# Altium schematic sheet 3_esc_power_sw.SchDoc: ESC power switch
size A3; SheetNumber: 3; SheetTotal: 4
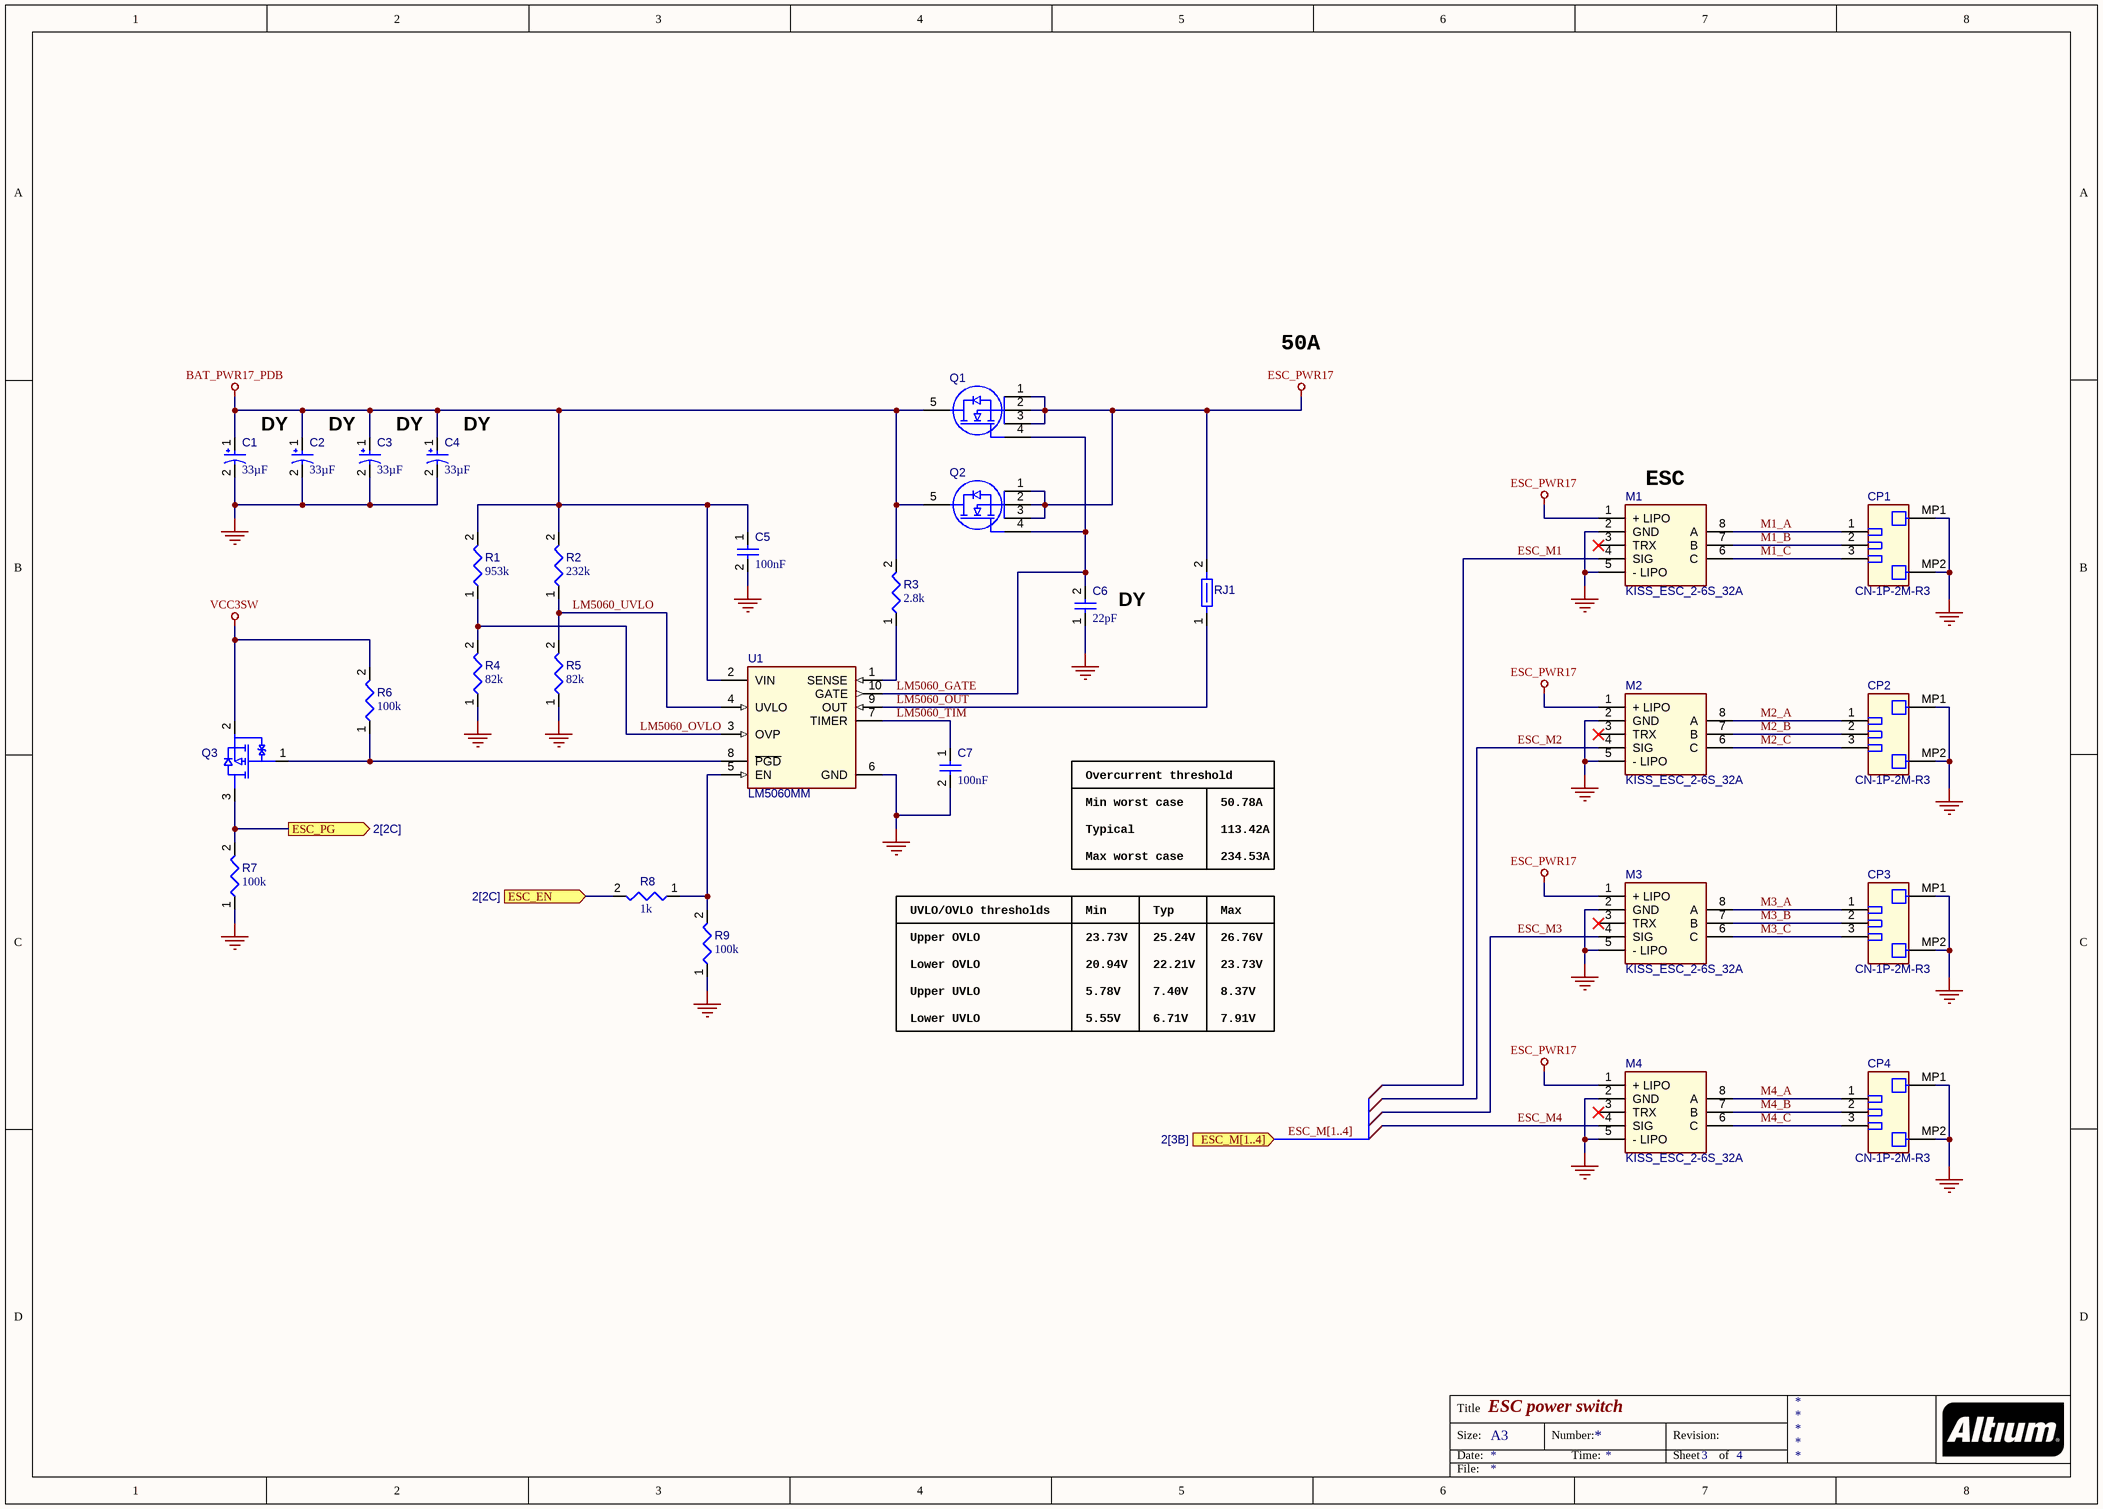
[diagram p0: 3_esc_power_sw.SchDoc]

## Parts
C1  value 33µF  [EEF-CX1E330R-Footprint-1]  (hidden comment: Capacitor 33µF +/-20% 25V 2917)
C2  value 33µF  [EEF-CX1E330R-Footprint-1]  (hidden comment: Capacitor 33µF +/-20% 25V 2917)
C3  value 33µF  [EEF-CX1E330R-Footprint-1]  (hidden comment: Capacitor 33µF +/-20% 25V 2917)
C4  value 33µF  [EEF-CX1E330R-Footprint-1]  (hidden comment: Capacitor 33µF +/-20% 25V 2917)
C5  value 100nF  [CAPC0402(1005)60_L]  (hidden comment: Capacitor 100nF +/-20% 50V 0402)
C6  value 22pF  [CAPC0402(1005)60_L]  (hidden comment: Capacitor 22pF +/-10% 50V 0402)
C7  value 100nF  [CAPC0402(1005)60_L]  (hidden comment: Capacitor 100nF +/-20% 50V 0402)
CP1  CN-1P-2M-R3  [MR30PW-FB-Footprint-1]
CP2  CN-1P-2M-R3  [MR30PW-FB-Footprint-1]
CP3  CN-1P-2M-R3  [MR30PW-FB-Footprint-1]
CP4  CN-1P-2M-R3  [MR30PW-FB-Footprint-1]
M1  KISS_ESC_2-6S_32A  [ESC 2-6S 32A-Footprint-1]
M2  KISS_ESC_2-6S_32A  [ESC 2-6S 32A-Footprint-1]
M3  KISS_ESC_2-6S_32A  [ESC 2-6S 32A-Footprint-1]
M4  KISS_ESC_2-6S_32A  [ESC 2-6S 32A-Footprint-1]
Q1  PSMN1R0-30YLDX  [NXP-SOT669_L]  (value not drawn)
Q2  PSMN1R0-30YLDX  [NXP-SOT669_L]  (value not drawn)
Q3  RZM002P02T2L  [ROHM-SOT723-3_V]  (value not drawn)
R1  value 953k  [RESC0402(1005)_L]  (hidden comment: Resistor 953K +/-1 % 0402 63 mW)
R2  value 232k  [RESC0402(1005)_L]  (hidden comment: Resistor 232K +/-1 % 0402 63 mW)
R3  value 2.8k  [RESC0402(1005)_L]  (hidden comment: Resistor 2K8  +/-1 % 0402 63 mW)
R4  value 82k  [RESC0402(1005)_L]  (hidden comment: Resistor 82K  +/-1 % 0402 63 mW)
R5  value 82k  [RESC0402(1005)_L]  (hidden comment: Resistor 82K  +/-1 % 0402 63 mW)
R6  value 100k  [RESC0402(1005)_L]  (hidden comment: Resistor 100K +/-1 % 0402 63 mW)
R7  value 100k  [RESC0402(1005)_L]  (hidden comment: Resistor 100K +/-1 % 0402 63 mW)
R8  value 1k  [RESC0402(1005)_L]  (hidden comment: Resistor 1K +/-5 % 0402 63 mW)
R9  value 100k  [RESC0402(1005)_L]  (hidden comment: Resistor 100K +/-1 % 0402 63 mW)
RJ1  Net Tie 10x8mil  [New footprint 1]  (value not drawn)  (net tie, no BOM)
U1  LM5060MM  [DGS0010A_N]

## Ports
ESC_EN (in, see 2[2C]), ESC_M[1..4] (in, see 2[3B]), ESC_PG (out, see 2[2C])

## Nets
BAT_PWR17_PDB: C1.1 C2.1 C3.1 C4.1 C5.1 Q1.5(D) Q2.5(D) R1.2 R2.2 R3.2 U1.2(VIN)
ESC_PWR17: M1.1(+_LIPO) M2.1(+_LIPO) M3.1(+_LIPO) M4.1(+_LIPO) Q1.1(S) Q1.2(S) Q1.3(S) Q2.1(S) Q2.2(S) Q2.3(S) RJ1.2
GND: C1.2 C2.2 C3.2 C4.2 C5.2 C6.1 C7.2 CP1.MP1 CP1.MP2 CP2.MP1 CP2.MP2 CP3.MP1 CP3.MP2 CP4.MP1 CP4.MP2 M1.2(GND) M1.5(-_LIPO) M2.2(GND) M2.5(-_LIPO) M3.2(GND) M3.5(-_LIPO) M4.2(GND) M4.5(-_LIPO) R4.1 R5.1 R7.1 R9.1 U1.6(GND)
VCC3SW: Q3.2(S) R6.2
ESC_EN: R8.2 ; port ESC_EN
ESC_M1: M1.4(SIG)
ESC_M2: M2.4(SIG)
ESC_M3: M3.4(SIG)
ESC_M4: M4.4(SIG)
ESC_PG: Q3.3(D) R7.2 ; port ESC_PG
LM5060_GATE: C6.2 Q1.4(G) Q2.4(G) U1.10(GATE)
LM5060_OUT: RJ1.1 U1.9(OUT)
LM5060_OVLO: R1.1 R4.2 U1.3(OVP)
LM5060_TIM: C7.1 U1.7(TIMER)
LM5060_UVLO: R2.1 R5.2 U1.4(UVLO)
M1_A: CP1.1 M1.8(A)
M1_B: CP1.2 M1.7(B)
M1_C: CP1.3 M1.6(C)
M2_A: CP2.1 M2.8(A)
M2_B: CP2.2 M2.7(B)
M2_C: CP2.3 M2.6(C)
M3_A: CP3.1 M3.8(A)
M3_B: CP3.2 M3.7(B)
M3_C: CP3.3 M3.6(C)
M4_A: CP4.1 M4.8(A)
M4_B: CP4.2 M4.7(B)
M4_C: CP4.3 M4.6(C)
NetQ3_1: Q3.1(G) R6.1 U1.8(~{PGD})
NetR3_1: R3.1 U1.1(SENSE)
NetR8_1: R8.1 R9.2 U1.5(EN)

Not connected (* = marked no-connect by the designer): M1 3(TRX)*; M2 3(TRX)*; M3 3(TRX)*; M4 3(TRX)*

## Buses and harness runs
bus ESC_M[1..4] = port ESC_M[1..4]

## Notes on the sheet
- 50A
- DY
- (near C4) DY
- (near M1) ESC
- (near C6) DY
- Overcurrent threshold
- Min worst case
- Typical
- Max worst case
- 50.78A
- 113.42A
- 234.53A
- UVLO/OVLO thresholds
- Min
- Typ
- Max
- Upper OVLO
- Lower OVLO
- Upper UVLO
- 23.73V
- 20.94V
- 5.78V
- 25.24V
- 22.21V
- 7.40V
- 26.76V
- 8.37V
- Lower UVLO
- 5.55V
- 6.71V
- 7.91V
- Title
- Size:
- Date:
- A3
- Number:
- Time:
- Revision:
- Sheet
- of
- File:

## Library data of the parts
C1-C4 = CMP-001-00064-3: Aluminum Organic Polymer Capacitors 33uF 25volt SP-Cap AEC-Q200; Tolerance: 20%; Case/Package: 2917; Voltage Rating: 25V; Mounting Technology: SMT; Min Operating Temperature: -40°C; Max Operating Temperature: 105°C; Pins: 2
C5 C7 = CMP-001-00067-3: Chip Capacitor, 100nF +/-20%, 50V, 0402, Thickness 0.6 mm; Tolerance: 10%; Mounting Technology: SMT; Voltage Rating: 50V; Pins: 2; Case/Package: 0402; Max Operating Temperature: 85°C; Min Operating Temperature: -55°C
C6 = CMP-001-00073-3: Chip Capacitor, 22pF +/-10%, 50V, 0402, Thickness 0.6 mm; Tolerance: 10%; Mounting Technology: SMT; Pins: 2; Voltage Rating: 50V; Case/Package: 0402; Max Operating Temperature: 85°C; Min Operating Temperature: -55°C
CP1-CP4 = CMP-002-00056-3: AMASS 500V 15A   0.8 mOhm; Pins: 5
M1-M4 = CMP-00030-00000-2: KISS ESC 2-6S 32A (45A limit) - 32bit brushless Motor Ctrl; Pins: 8
Q1 Q2 = CMP-013-00029-2: N-channel Logic Level MOSFET, 30 V, 300 A, -55 to 175 degC, 5-Pin SOT669, RoHS, Tape and Reel; Transistor Type: 1N-Channel; Vgs (Max): 20V; Pins: 5; RoHS Compliant: True
Q3 = CMP-013-00027-2: Pch Small Signal MOSFET, 20 V, 200 mA, 3-Pin SOT723, RoHS, Tape and Reel; Vgs(th) (Max) @ Id: 1V@100µA; Pins: 3
R1 = CMP-009-00125-3: Chip Resistor, 953 kOhms, +/-1 %, 63 mW, -55 to 155 degC, 0402; Power: 63mW; Tolerance: 1%; Case/Package: 0402; Max Operating Temperature: 155°C; Min Operating Temperature: -55°C; Pins: 2
R2 = CMP-009-00127-3: Chip Resistor, 232 kOhms, +/-1 %, 63 mW, -55 to 155 degC, 0402; Tolerance: 1%; Power: 63mW; Case/Package: 0402; Pins: 2
R3 = CMP-009-00156-3: Chip Resistor, 2,8 kOhms, +/-1 %, 63 mW, -55 to 155 degC, 0402; Power: 63mW; Tolerance: 1%; Case/Package: 0402; Pins: 2
R4 R5 = CMP-009-00140-3: Chip Resistor, 82 kOhms, +/-1 %, 63 mW, -55 to 155 degC, 0402; Tolerance: 1%; Power: 63mW; Case/Package: 0402; Pins: 2
R6 R7 R9 = CMP-009-00168-3: Chip Resistor, 100 kOhms, +/-1 %, 63 mW, -55 to 155 degC, 0402; Tolerance: 1%; Power: 63mW; Case/Package: 0402; Max Operating Temperature: 155°C; Min Operating Temperature: -55°C; Pins: 2
R8 = CMP-009-00157-3: Chip Resistor, 1 kOhms, +/-5 %, 63 mW, -55 to 155 degC, 0402; Tolerance: 5%; Power: 63mW; Case/Package: 0402; Max Operating Temperature: 155°C; Min Operating Temperature: -55°C; Pins: 2
RJ1 = CMP-009-00116-2: Pins: 2; Max Operating Temperature: 155°C; Min Operating Temperature: -55°C
U1 = CMP-019-00039-3: High-Side Protection Controller with Low Quiescent Current, 5.5 to 65 V, -40 to 125 degC, 10-Pin VSSOP, RoHS, Tape and Reel; Max Supply Voltage: 65V; Min Supply Voltage: 5.5V; Min Operating Temperature: -40°C; Max Operating Temperature: 125°C; Pins: 10